# Altium project PCB_Project_CDCEMU2000HW01.PrjPcb
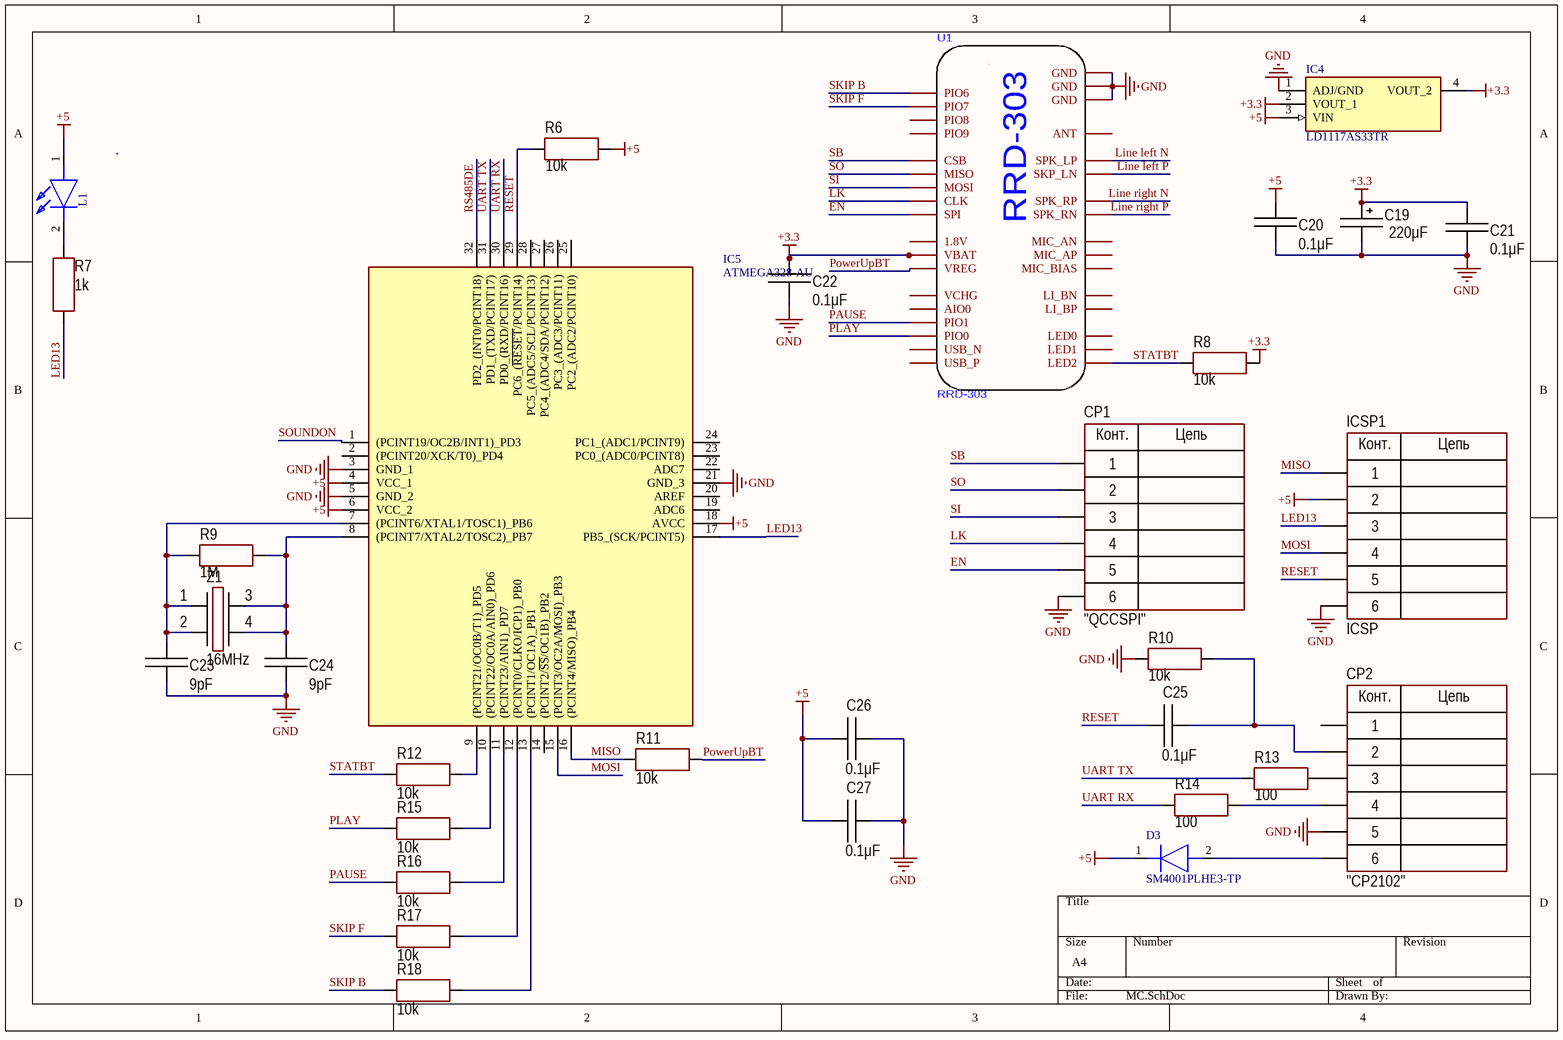
[diagram p0: MC.SchDoc]
3 sheets, 113 parts. Net scope: global (net labels, ports and power ports of the same name join across sheets).
Board file: PCB_CDCEMU2000HW01.PcbDoc
Sheets:
  MC.SchDoc
  Relay and connector.SchDoc
  DIFFAMP.SchDoc

## Sheet MC.SchDoc
size A4; SheetNumber: 1; SheetTotal: 3

### Parts
C19  value 220μF  [CAP: D10C5H20]
C20  value 0.1μF  [CAP: 0805]
C21  value 0.1μF  [CAP: 0805]
C22  value 0.1μF  [CAP: 0805]
C23  value 9pF  [CAP: 0805]
C24  value 9pF  [CAP: 0805]
C25  value 0.1μF  [CAP: 0805]
C26  value 0.1μF  [CAP: 0805]
C27  value 0.1μF  [CAP: 0805]
CP1  CommentText: "QCCSPI"  [CON: PLS-6]
CP2  CommentText: "CP2102"  [CON: PLS-6]
D3  SM4001PLHE3-TP  [SODFL3616X135N]
IC4  LD1117AS33TR  [SOT230P700X190-4N]
IC5  ATMEGA328-AU  [QFP80P900X900X120-32N]
ICSP1  CommentText: ICSP  [CON: PBD-6]
L1  KP2012SGC  [KP2012SGC]  (value not drawn)
R6  value 10k  [RES: 0805]
R7  value 1k  [RES: 0805]
R8  value 10k  [RES: 0805]
R9  value 1M  [RES: 0805]
R10  value 10k  [RES: 0805]
R11  value 10k  [RES: 0805]
R12  value 10k  [RES: 0805]
R13  value 100  [RES: 0805]
R14  value 100  [RES: 0805]
R15  value 10k  [RES: 0805]
R16  value 10k  [RES: 0805]
R17  value 10k  [RES: 0805]
R18  value 10k  [RES: 0805]
U1  RRD-303  [RRD-303]
Z1  Frequency: 16MHz  [OSC: 2520]

### Nets
+3.3: C19.1 C21.1 C22.1 IC4.2(VOUT_1) IC4.4(VOUT_2) R8.2 U1.12(VBAT)
+5: C20.1 C26.2 C27.2 D3.1(K) IC4.3(VIN) IC5.4(VCC_1) IC5.6(VCC_2) IC5.18(AVCC) ICSP1.2 L1.1(A) R6.2
GND: C19.2 C20.2 C21.2 C22.2 C23.2 C24.2 C26.1 C27.1 CP1.6 CP2.5 IC4.1(ADJ/GND) IC5.3(GND_1) IC5.5(GND_2) IC5.21(GND_3) ICSP1.6 R10.1 U1.1(GND) U1.15(GND) U1.27(GND)
EN: CP1.5 U1.10(SPI)
LED13: IC5.17(PB5_(SCK/PCINT5)) ICSP1.3 R7.1
Line left N: U1.16(SPK_LP)
Line left P: U1.17(SKP_LN)
Line right N: U1.18(SPK_RP)
Line right P: U1.19(SPK_RN)
LK: CP1.4 U1.9(CLK)
MISO: IC5.16((PCINT4/MISO)_PB4) ICSP1.1 R11.1
MOSI: IC5.15((PCINT3/OC2A/MOSI)_PB3) ICSP1.4
PAUSE: R16.1 U1.30(PIO1)
PLAY: R15.1 U1.31(PIO0)
PowerUpBT: R11.2 U1.13(VREG)
RESET: C25.2 IC5.29(PC6_(~{RESET}/PCINT14)) ICSP1.5 R6.1
RS485DE: IC5.32(PD2_(INT0/PCINT18))
SB: CP1.1 U1.6(CSB)
SI: CP1.3 U1.8(MOSI)
SKIP B: R18.1 U1.2(PIO6)
SKIP F: R17.1 U1.3(PIO7)
SO: CP1.2 U1.7(MISO)
SOUNDON: IC5.1((PCINT19/OC2B/INT1)_PD3)
STATBT: R8.1 R12.1 U1.34(LED2)
UART RX: IC5.30(PD0_(RXD/PCINT16)) R14.1
UART TX: IC5.31(PD1_(TXD/PCINT17)) R13.1
NetC23_1: C23.1 IC5.7((PCINT6/XTAL1/TOSC1)_PB6) R9.1 Z1.1 Z1.2
NetC24_1: C24.1 IC5.8((PCINT7/XTAL2/TOSC2)_PB7) R9.2 Z1.3 Z1.4
NetC25_1: C25.1 CP2.2 R10.2
NetCP2_3: CP2.3 R13.2
NetCP2_4: CP2.4 R14.2
NetCP2_6: CP2.6 D3.2(A)
NetIC5_9: IC5.9((PCINT21/OC0B/T1)_PD5) R12.2
NetIC5_10: IC5.10((PCINT22/OC0A/AIN0)_PD6) R15.2
NetIC5_11: IC5.11((PCINT23/AIN1)_PD7) R16.2
NetIC5_12: IC5.12((PCINT0/CLKO/ICP1)_PB0) R17.2
NetIC5_13: IC5.13((PCINT1/OC1A)_PB1) R18.2
NetL1_2: L1.2(K) R7.2

Not connected (* = marked no-connect by the designer): CP2 1; IC5 2((PCINT20/XCK/T0)_PD4) 14((PCINT2/~{SS}/OC1B)_PB2) 19(ADC6) 20(AREF) 22(ADC7) 23(PC0_(ADC0/PCINT8)) 24(PC1_(ADC1/PCINT9)) 25(PC2_(ADC2/PCINT10)) 26(PC3_(ADC3/PCINT11)) 27(PC4_(ADC4/SDA/PCINT12)) 28(PC5_(ADC5/SCL/PCINT13)); U1 4(PIO8) 5(PIO9) 11(1.8V) 14(ANT) 20(MIC_AN) 21(MIC_AP) 22(MIC_BIAS) 23(LI_BN) 24(LI_BP) 25(LED0) 26(LED1) 28(VCHG) 29(AIO0) 32(USB_N) 33(USB_P)

### Notes on the sheet
- (in symbol PBD-6) Конт.; Цепь
- (in symbol PLS-6) Конт.; Цепь

### Library data of the parts
C19 = Aluminium: Manufacturer: Wurth; PartNumber: 860080475013; ValueManufacturerPartNumber: Aluminium capacitor, 220μF, 25V, ±20%, 54mOhm, 14x10x5 mm, -55...+105°C; TypeCapacitor: Aluminium capacitor; Tolerance: ±20%; Impedance: 54mOhm; Voltage: 25V; Package: 14x10x5 mm; HelpURL: https://www.digikey.com/product-detail/en/wurth-electronics-inc/860080475013/732-9029-1-ND/5728972; Temperature: -55...+105°C
C20-C27 = Ceramic_0805: Manufacturer: Yageo; PartNumber: CC0805KRX7R7BB104; TypeCapacitor: Ceramic capacitor; Tolerance: ±10%; TypeDielectric: X7R; Package: 0805; HelpURL: https://www.digikey.com/product-detail/en/yageo/CC0805KRX7R7BB104/311-1142-1-ND/303052; ValueManufacturerPartNumber: =TypeCapacitor+', '+Value+', '+TypeDielectric+', '+Tolerance+', '+Voltage+', '+Package+', '+Temperature; Temperature: -55...+125°C
CP1 CP2 = PLS-6: Manufacturer: Connfly; ValueManufacturerPartNumber: Connector, 6pin, 2.54mm, 500VAC, 3A; TypeConnector: Connector; VoltageMax: 500VAC; Pitch: 2.54mm; CurrentMax: 3A; Multichannel: 6pin; HelpURL: https://www.chipdip.ru/product/pls-6; PartNumber: PLS-6
D3 = SM4001PLHE3-TP: Diode; Manufacturer_Name: MCC; Datasheet Link: https://www.mccsemi.com/pdf/Products/SM4001PLHE3-SM4007PLHE3(SOD-123FL).pdf; Height: 1.35mm; Manufacturer_Part_Number: SM4001PLHE3-TP; Mouser Part Number: 833-SM4001PLHE3-TP; Mouser Price/Stock: https://www.mouser.co.uk/ProductDetail/Micro-Commercial-Components-MCC/SM4001PLHE3-TP?qs=QNEnbhJQKvZveZWFAoodWg%3D%3D; Arrow Part Number: SM4001PLHE3-TP; Arrow Price/Stock: https://www.arrow.com/en/products/sm4001plhe3-tp/micro-commercial-components?region=nac
IC4 = LD1117AS33TR: Power Supply; Manufacturer_Name: STMicroelectronics; Datasheet Link: https://4donline.ihs.com/images/VipMasterIC/IC/SGST/SGSTS49356/SGSTS49356-1.pdf?hkey=6D3A4C79FDBF58556ACFDE234799DDF0; Height: 1.9mm; Manufacturer_Part_Number: LD1117AS33TR; Mouser Part Number: 511-LD1117AS33; Mouser Price/Stock: https://www.mouser.co.uk/ProductDetail/STMicroelectronics/LD1117AS33TR?qs=C3bf%2FVrkE5CoDDd7wyn%252BaQ%3D%3D; Arrow Part Number: LD1117AS33TR; Arrow Price/Stock: https://www.arrow.com/en/products/ld1117as33tr/stmicroelectronics?region=europe
IC5 = ATMEGA328-AU: Integrated Circuit; Manufacturer_Name: Microchip; Datasheet Link: https://ww1.microchip.com/downloads/en/DeviceDoc/ATmega48A-PA-88A-PA-168A-PA-328-P-DS-DS40002061B.pdf; Height: 1.2mm; Manufacturer_Part_Number: ATMEGA328-AU; Mouser Part Number: 556-ATMEGA328-AU; Mouser Price/Stock: https://www.mouser.co.uk/ProductDetail/Microchip-Technology/ATMEGA328-AU?qs=lwdSMh1%2FoYJRHuGBjWz9Pg%3D%3D; Arrow Part Number: ATMEGA328-AU; Arrow Price/Stock: https://www.arrow.com/en/products/atmega328-au/microchip-technology?region=europe
ICSP1 = PBD-6: Manufacturer: Connfly; ValueManufacturerPartNumber: Connector, 6pin, 2.54mm, 500VAC, 3A; TypeConnector: Connector; VoltageMax: 500VAC; Pitch: 2.54mm; CurrentMax: 3A; Multichannel: 6pin; HelpURL: https://www.chipdip.ru/product/pbd-6; PartNumber: PBD-6
L1 = KP2012SGC: LED; Manufacturer_Name: Kingbright; Datasheet Link: https://docs.rs-online.com/9e3e/0900766b8032fa8b.pdf; Height: 1.1mm; Manufacturer_Part_Number: KP2012SGC; Mouser Part Number: N/A; Mouser Price/Stock: https://www.mouser.co.uk/ProductDetail/Kingbright/KP2012SGC?qs=5aG0NVq1C4xgkmzx8ebWbQ%3D%3D
R6 R8 R10-R12 R15-R18 = Resistor_0805: Manufacturer: Yageo; PartNumber: RC0805JR-07100RL; ValueManufacturerPartNumber: Resistor film, 10k, ±5%, 0805, 0.125W, -55...+125°C; TypeResistor: Resistor film; Power: 0.125W; Tolerance: ±5%; Package: 0805; HelpURL: https://www.digikey.com/product-detail/en/yageo/RC0805JR-07100RL/311-100ARCT-ND/731185; Temperature: -55...+125°C
R7 = Resistor_0805: Manufacturer: Yageo; PartNumber: RC0805JR-07100RL; ValueManufacturerPartNumber: Resistor film, 1k, ±5%, 0805, 0.125W, -55...+125°C; TypeResistor: Resistor film; Power: 0.125W; Tolerance: ±5%; Package: 0805; HelpURL: https://www.digikey.com/product-detail/en/yageo/RC0805JR-07100RL/311-100ARCT-ND/731185; Temperature: -55...+125°C
R9 = Resistor_0805: Manufacturer: Yageo; PartNumber: RC0805JR-07100RL; ValueManufacturerPartNumber: Resistor film, 1M, ±5%, 0805, 0.125W, -55...+125°C; TypeResistor: Resistor film; Power: 0.125W; Tolerance: ±5%; Package: 0805; HelpURL: https://www.digikey.com/product-detail/en/yageo/RC0805JR-07100RL/311-100ARCT-ND/731185; Temperature: -55...+125°C
R13 R14 = Resistor_0805: Manufacturer: Yageo; PartNumber: RC0805JR-07100RL; ValueManufacturerPartNumber: Resistor film, 100, ±5%, 0805, 0.125W, -55...+125°C; TypeResistor: Resistor film; Power: 0.125W; Tolerance: ±5%; Package: 0805; HelpURL: https://www.digikey.com/product-detail/en/yageo/RC0805JR-07100RL/311-100ARCT-ND/731185; Temperature: -55...+125°C
Z1 = Crystal_2520: Manufacturer: Epson; PartNumber: FA-20H 16.0000MF20X-B; ValueManufacturerPartNumber: Crystal, 16MHz, 16pF, ±20ppm, case 2520, -40...+85°C; LoadCapacitance: 16pF; Tolerance: ±20ppm; Package: case 2520; HelpURL: https://www.digikey.com/product-detail/en/epson/FA-20H-16.0000MF20X-B/SER4202-ND/7430937; Temperature: -40...+85°C; TypeOscilator: Crystal

## Sheet Relay and connector.SchDoc
size A4; SheetNumber: 2; SheetTotal: 3
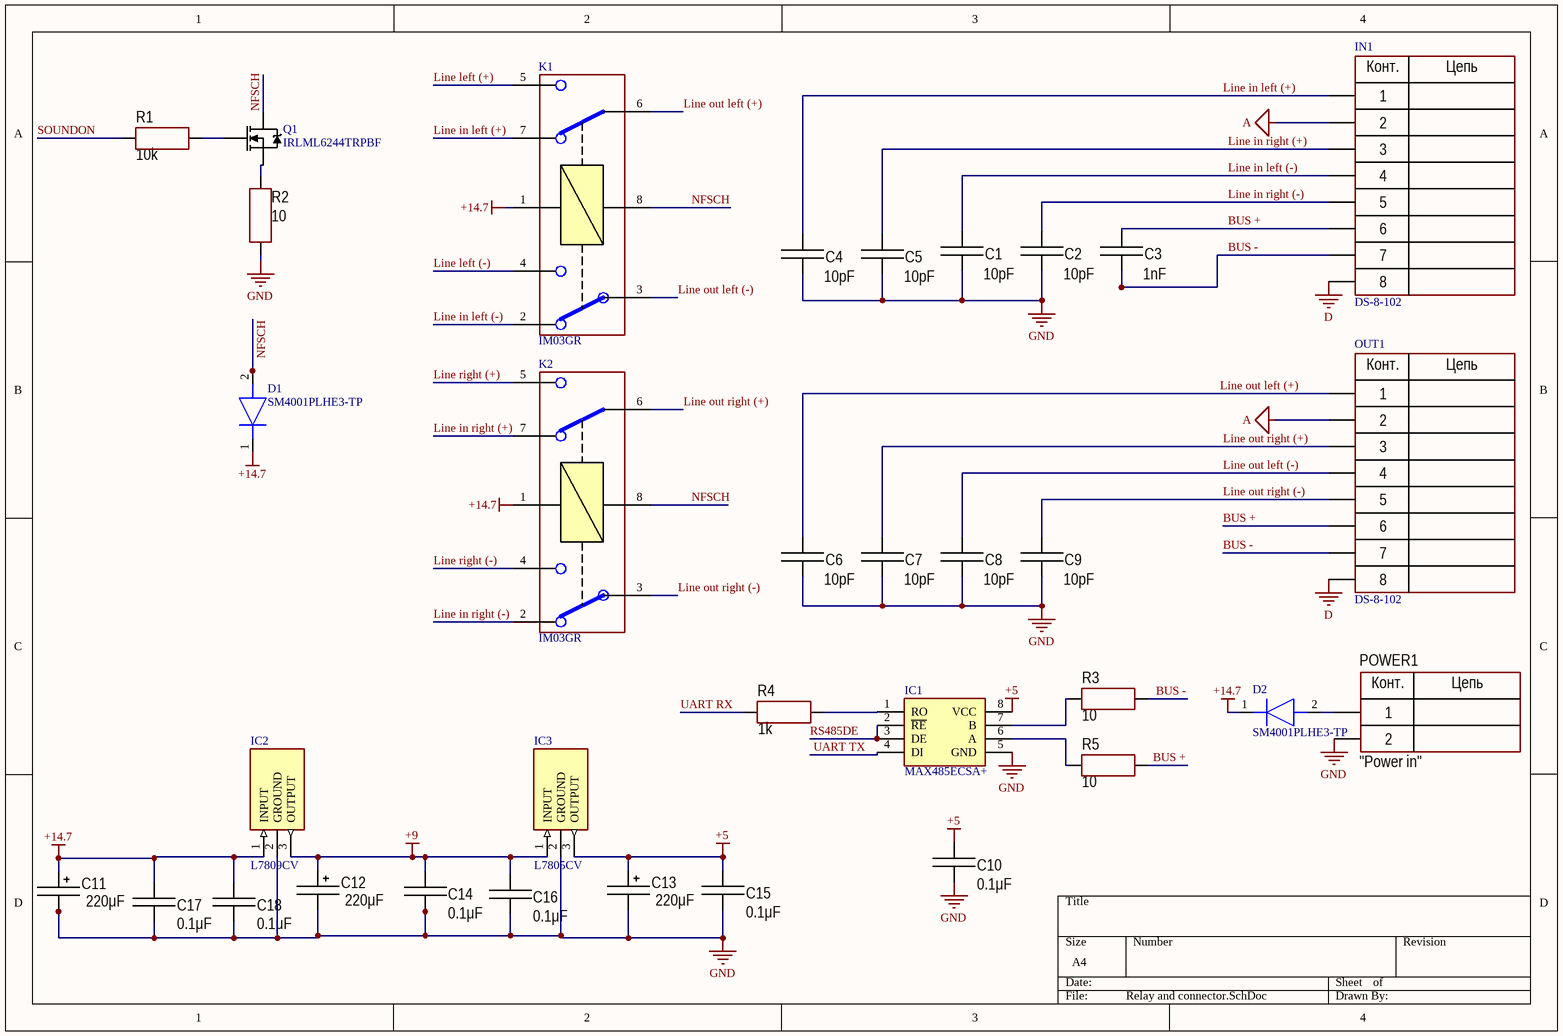
[diagram p1: Relay and connector.SchDoc]

### Parts
C1  value 10pF  [CAP: 0805]
C2  value 10pF  [CAP: 0805]
C3  value 1nF  [CAP: 0805]
C4  value 10pF  [CAP: 0805]
C5  value 10pF  [CAP: 0805]
C6  value 10pF  [CAP: 0805]
C7  value 10pF  [CAP: 0805]
C8  value 10pF  [CAP: 0805]
C9  value 10pF  [CAP: 0805]
C10  value 0.1μF  [CAP: 0805]
C11  value 220μF  [CAP: D10C5H20]
C12  value 220μF  [CAP: D10C5H20]
C13  value 220μF  [CAP: D10C5H20]
C14  value 0.1μF  [CAP: 0805]
C15  value 0.1μF  [CAP: 0805]
C16  value 0.1μF  [CAP: 0805]
C17  value 0.1μF  [CAP: 0805]
C18  value 0.1μF  [CAP: 0805]
D1  SM4001PLHE3-TP  [SODFL3616X135N]
D2  SM4001PLHE3-TP  [SODFL3616X135N]
IC1  MAX485ECSA+  [SOIC127P600X175-8N]
IC2  L7809CV  [TO255P460X1020X2008-3P]
IC3  L7805CV  [TO255P460X1020X2008-3P]
IN1  DS-8-102  [DS-8-102]
K1  IM03GR  [IM06GR]
K2  IM03GR  [IM06GR]
OUT1  DS-8-102  [DS-8-102]
POWER1  CommentText: "Power in"  [CON: CWF-2]
Q1  IRLML6244TRPBF  [SOT95P237X112-3N]
R1  value 10k  [RES: 0805]
R2  value 10  [RES: 0805]
R3  value 10  [RES: 0805]
R4  value 1k  [RES: 0805]
R5  value 10  [RES: 0805]

### Nets
+5: C10.1 C13.1 C15.1 IC1.8(VCC) IC3.3(OUTPUT)
+9: C12.1 C14.1 C16.1 IC2.3(OUTPUT) IC3.1(INPUT)
+14.7: C11.1 C17.1 C18.1 D1.1(K) D2.1(K) IC2.1(INPUT) K1.1 K2.1
A: IN1.2 OUT1.2
D: IN1.8 OUT1.8
GND: C1.1 C2.1 C4.1 C5.1 C6.1 C7.1 C8.1 C9.1 C10.2 C11.2 C12.2 C13.2 C14.2 C15.2 C16.2 C17.2 C18.2 IC1.5(GND) IC2.2(GROUND) IC3.2(GROUND) POWER1.2 R2.1
BUS +: C3.2 IN1.6 OUT1.6 R5.2
BUS -: C3.1 IN1.7 OUT1.7 R3.2
Line in left (+): C4.2 IN1.1 K1.7
Line in left (-): C1.2 IN1.4 K1.2
Line in right (+): C5.2 IN1.3 K2.7
Line in right (-): C2.2 IN1.5 K2.2
Line left (+): K1.5
Line left (-): K1.4
Line out left (+): C6.2 K1.6 OUT1.1
Line out left (-): C8.2 K1.3 OUT1.4
Line out right (+): C7.2 K2.6 OUT1.3
Line out right (-): C9.2 K2.3 OUT1.5
Line right (+): K2.5
Line right (-): K2.4
NFSCH: D1.2(A) K1.8 K2.8 Q1.3(D)
RS485DE: IC1.2(~{RE}) IC1.3(DE)
SOUNDON: R1.1
UART RX: R4.1
UART TX: IC1.4(DI)
NetD2_2: D2.2(A) POWER1.1
NetIC1_1: IC1.1(RO) R4.2
NetIC1_6: IC1.6(A) R5.1
NetIC1_7: IC1.7(B) R3.1
NetQ1_1: Q1.1(G) R1.2
NetQ1_2: Q1.2(S) R2.2

### Notes on the sheet
- (in symbol CWF-2) Конт.; Цепь
- (in symbol DS-8-102) Конт.; Цепь

### Library data of the parts
C1 C2 C4-C9 = Ceramic_0805: Manufacturer: Yageo; PartNumber: CC0805KRX7R7BB104; ValueManufacturerPartNumber: Ceramic capacitor, 10pF, X7R, ±10%, 16V, 0805, -55...+125°C; TypeCapacitor: Ceramic capacitor; Tolerance: ±10%; TypeDielectric: X7R; Voltage: 16V; Package: 0805; HelpURL: https://www.digikey.com/product-detail/en/yageo/CC0805KRX7R7BB104/311-1142-1-ND/303052; Temperature: -55...+125°C
C3 = Ceramic_0805: Manufacturer: Yageo; PartNumber: CC0805KRX7R7BB104; ValueManufacturerPartNumber: Ceramic capacitor, 1nF, X7R, ±10%, 16V, 0805, -55...+125°C; TypeCapacitor: Ceramic capacitor; Tolerance: ±10%; TypeDielectric: X7R; Voltage: 16V; Package: 0805; HelpURL: https://www.digikey.com/product-detail/en/yageo/CC0805KRX7R7BB104/311-1142-1-ND/303052; Temperature: -55...+125°C
C10 C14-C18 = Ceramic_0805: as C20 on sheet MC; Package: 0805; HelpURL: https://www.digikey.com/product-detail/en/yageo/CC0805KRX7R7BB104/311-1142-1-ND/303052; ValueManufacturerPartNumber: =TypeCapacitor+', '+Value+', '+TypeDielectric+', '+Tolerance+', '+Voltage+', '+Package+', '+Temperature; Temperature: -55...+125°C
C11-C13 = Aluminium: as C19 on sheet MC; Package: 14x10x5 mm; HelpURL: https://www.digikey.com/product-detail/en/wurth-electronics-inc/860080475013/732-9029-1-ND/5728972; Temperature: -55...+105°C
D1 D2 = SM4001PLHE3-TP: Diode; Manufacturer_Name: MCC; Datasheet Link: https://www.mccsemi.com/pdf/Products/SM4001PLHE3-SM4007PLHE3(SOD-123FL).pdf; Height: 1.35mm; Manufacturer_Part_Number: SM4001PLHE3-TP; Mouser Part Number: 833-SM4001PLHE3-TP; Mouser Price/Stock: https://www.mouser.co.uk/ProductDetail/Micro-Commercial-Components-MCC/SM4001PLHE3-TP?qs=QNEnbhJQKvZveZWFAoodWg%3D%3D; Arrow Part Number: SM4001PLHE3-TP; Arrow Price/Stock: https://www.arrow.com/en/products/sm4001plhe3-tp/micro-commercial-components?region=nac
IC1 = MAX485ECSA+: Integrated Circuit; Manufacturer_Name: Analog Devices; Datasheet Link: http://datasheets.maximintegrated.com/en/ds/MAX1487E-MAX491E.pdf; Height: 1.75mm; Manufacturer_Part_Number: MAX485ECSA+; Mouser Part Number: 700-MAX485ECSA; Mouser Price/Stock: https://www.mouser.co.uk/ProductDetail/Analog-Devices-Maxim-Integrated/MAX485ECSA%2b?qs=1THa7WoU59Gy3FCdT5o1Tg%3D%3D; Arrow Part Number: MAX485ECSA+; Arrow Price/Stock: https://www.arrow.com/en/products/max485ecsa/maxim-integrated?region=nac
IC2 = L7809CV: Integrated Circuit; Manufacturer_Name: STMicroelectronics; Datasheet Link: http://www.st.com/web/en/resource/technical/document/datasheet/CD00000444.pdf; Height: 4.6mm; Manufacturer_Part_Number: L7809CV; Mouser Part Number: 511-L7809CV; Mouser Price/Stock: https://www.mouser.co.uk/ProductDetail/STMicroelectronics/L7809CV?qs=sps7W%2FwBcGH358Eg%2FiFhSA%3D%3D; Arrow Part Number: L7809CV; Arrow Price/Stock: https://www.arrow.com/en/products/l7809cv/stmicroelectronics?region=europe
IC3 = L7805CV: Integrated Circuit; Manufacturer_Name: STMicroelectronics; Datasheet Link: http://www.st.com/web/en/resource/technical/document/datasheet/CD00000444.pdf; Height: 4.6mm; Manufacturer_Part_Number: L7805CV; Mouser Part Number: 511-L7805CV; Mouser Price/Stock: https://www.mouser.co.uk/ProductDetail/STMicroelectronics/L7805CV?qs=9NrABl3fj%2FqplZAHiYUxWg%3D%3D; Arrow Part Number: L7805CV; Arrow Price/Stock: https://www.arrow.com/en/products/l7805cv/stmicroelectronics?region=europe
K1 K2 = IM03GR: Relay or Contactor; Manufacturer_Name: TE Connectivity; Datasheet Link: https://datasheet.datasheetarchive.com/originals/distributors/Datasheets_SAMA/af0478e68580ade93768a4593bd7be66.pdf; Manufacturer_Part_Number: IM03GR; Mouser Part Number: 655-IM03GR; Mouser Price/Stock: https://www.mouser.co.uk/ProductDetail/TE-Connectivity/IM03GR?qs=h8jywBNgiq20bLq7q22y%252Bg%3D%3D; Arrow Part Number: IM03GR; Arrow Price/Stock: https://www.arrow.com/en/products/im03gr/te-connectivity?region=nac
POWER1 = CWF-2: Manufacturer: Connfly; ValueManufacturerPartNumber: Connector, 2pin, 2.54mm, 250VAC, 3A; PartNumber: CWF-2R; TypeConnector: Connector; VoltageMax: 250VAC; Pitch: 2.54mm; CurrentMax: 3A; Multichannel: 2pin; HelpURL: https://www.chipdip.ru/product/cwf-2r-ds1069-2-mr
Q1 = IRLML6244TRPBF: Transistor; Manufacturer_Name: Infineon; Datasheet Link: http://www.infineon.com/dgdl/irlml6244pbf.pdf?fileId=5546d462533600a4015356686fed261f; Height: 1.12mm; Manufacturer_Part_Number: IRLML6244TRPBF; Mouser Part Number: 942-IRLML6244TRPBF; Mouser Price/Stock: https://www.mouser.co.uk/ProductDetail/Infineon-Technologies/IRLML6244TRPBF?qs=9%252BKlkBgLFf1HkY%2F2U%252BIhLQ%3D%3D; Arrow Part Number: IRLML6244TRPBF; Arrow Price/Stock: https://www.arrow.com/en/products/irlml6244trpbf/infineon-technologies-ag?region=europe
R1 = Resistor_0805: as R6 on sheet MC; Package: 0805; HelpURL: https://www.digikey.com/product-detail/en/yageo/RC0805JR-07100RL/311-100ARCT-ND/731185; Temperature: -55...+125°C
R2 R3 R5 = Resistor_0805: Manufacturer: Yageo; PartNumber: RC0805JR-07100RL; ValueManufacturerPartNumber: Resistor film, 10, ±5%, 0805, 0.125W, -55...+125°C; TypeResistor: Resistor film; Power: 0.125W; Tolerance: ±5%; Package: 0805; HelpURL: https://www.digikey.com/product-detail/en/yageo/RC0805JR-07100RL/311-100ARCT-ND/731185; Temperature: -55...+125°C
R4 = Resistor_0805: as R7 on sheet MC; Package: 0805; HelpURL: https://www.digikey.com/product-detail/en/yageo/RC0805JR-07100RL/311-100ARCT-ND/731185; Temperature: -55...+125°C

## Sheet DIFFAMP.SchDoc
size A4; SheetNumber: 3; SheetTotal: 3
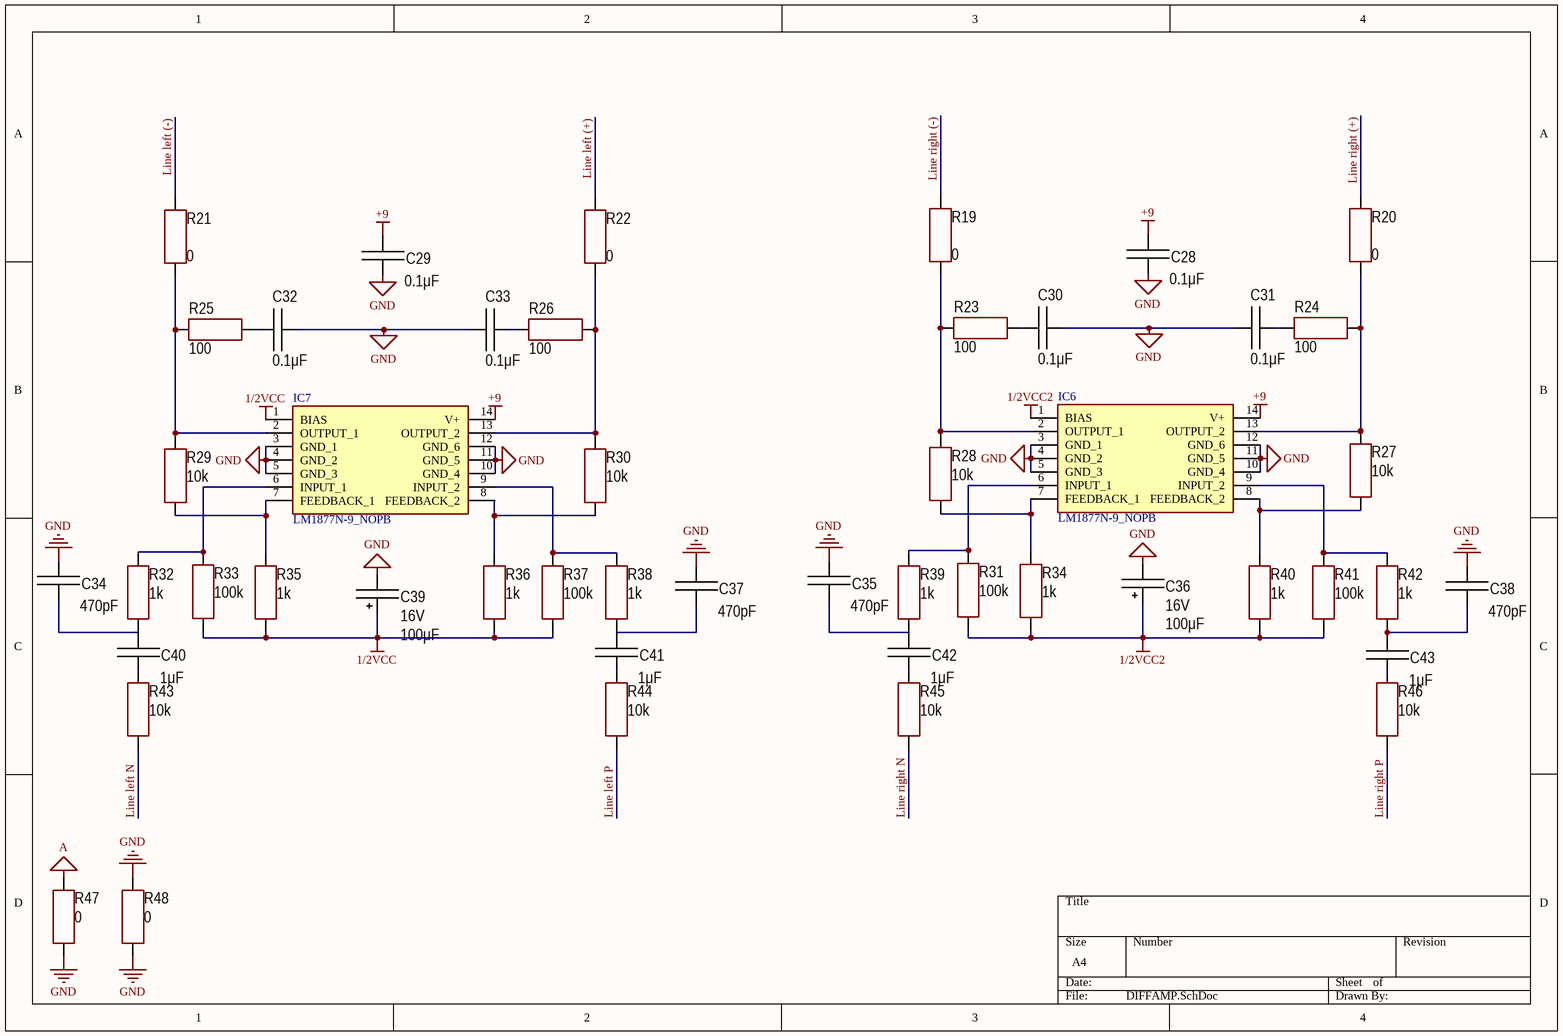
[diagram p2: DIFFAMP.SchDoc]

### Parts
C28  value 0.1μF  [CAP: 0805]
C29  value 0.1μF  [CAP: 0805]
C30  value 0.1μF  [CAP: 0805]
C31  value 0.1μF  [CAP: 0805]
C32  value 0.1μF  [CAP: 0805]
C33  value 0.1μF  [CAP: 0805]
C34  value 470pF  [CAP: 0805]
C35  value 470pF  [CAP: 0805]
C36  value 100μF  Voltage: 16V  [CAP: TANTAL-D]
C37  value 470pF  [CAP: 0805]
C38  value 470pF  [CAP: 0805]
C39  value 100μF  Voltage: 16V  [CAP: TANTAL-D]
C40  value 1μF  [CAP: 0805]
C41  value 1μF  [CAP: 0805]
C42  value 1μF  [CAP: 0805]
C43  value 1μF  [CAP: 0805]
IC6  LM1877N-9_NOPB  [DIP787W58P254L1918H508Q14N]
IC7  LM1877N-9_NOPB  [DIP787W58P254L1918H508Q14N]
R19  value 0  [RES: 0805]
R20  value 0  [RES: 0805]
R21  value 0  [RES: 0805]
R22  value 0  [RES: 0805]
R23  value 100  [RES: 0805]
R24  value 100  [RES: 0805]
R25  value 100  [RES: 0805]
R26  value 100  [RES: 0805]
R27  value 10k  [RES: 0805]
R28  value 10k  [RES: 0805]
R29  value 10k  [RES: 0805]
R30  value 10k  [RES: 0805]
R31  value 100k  [RES: 0805]
R32  value 1k  [RES: 0805]
R33  value 100k  [RES: 0805]
R34  value 1k  [RES: 0805]
R35  value 1k  [RES: 0805]
R36  value 1k  [RES: 0805]
R37  value 100k  [RES: 0805]
R38  value 1k  [RES: 0805]
R39  value 1k  [RES: 0805]
R40  value 1k  [RES: 0805]
R41  value 100k  [RES: 0805]
R42  value 1k  [RES: 0805]
R43  value 10k  [RES: 0805]
R44  value 10k  [RES: 0805]
R45  value 10k  [RES: 0805]
R46  value 10k  [RES: 0805]
R47  value 0  [RES: 0805]
R48  value 0  [RES: 0805]

### Nets
1/2VCC: C39.1 IC7.1(BIAS) R33.2 R35.2 R36.1 R37.2
1/2VCC2: C36.1 IC6.1(BIAS) R31.2 R34.2 R40.1 R41.2
+9: C28.2 C29.2 IC6.14(V+) IC7.14(V+)
A: R47.1
GND: C28.1 C29.1 C30.1 C31.1 C32.1 C33.1 C34.2 C35.2 C36.2 C37.2 C38.2 C39.2 IC6.3(GND_1) IC6.4(GND_2) IC6.5(GND_3) IC6.10(GND_4) IC6.11(GND_5) IC6.12(GND_6) IC7.3(GND_1) IC7.4(GND_2) IC7.5(GND_3) IC7.10(GND_4) IC7.11(GND_5) IC7.12(GND_6) R47.2 R48.1 R48.2
Line left (+): R22.2
Line left (-): R21.2
Line left N: R43.2
Line left P: R44.2
Line right (+): R20.2
Line right (-): R19.2
Line right N: R45.2
Line right P: R46.2
NetC30_2: C30.2 R23.1
NetC31_2: C31.2 R24.2
NetC32_2: C32.2 R25.1
NetC33_2: C33.2 R26.2
NetC34_1: C34.1 C40.2 R32.2
NetC35_1: C35.1 C42.2 R39.2
NetC37_1: C37.1 C41.2 R38.2
NetC38_1: C38.1 C43.2 R42.2
NetC40_1: C40.1 R43.1
NetC41_1: C41.1 R44.1
NetC42_1: C42.1 R45.1
NetC43_1: C43.1 R46.1
NetIC6_2: IC6.2(OUTPUT_1) R19.1 R23.2 R28.1
NetIC6_6: IC6.6(INPUT_1) R31.1 R39.1
NetIC6_7: IC6.7(FEEDBACK_1) R28.2 R34.1
NetIC6_8: IC6.8(FEEDBACK_2) R27.2 R40.2
NetIC6_9: IC6.9(INPUT_2) R41.1 R42.1
NetIC6_13: IC6.13(OUTPUT_2) R20.1 R24.1 R27.1
NetIC7_2: IC7.2(OUTPUT_1) R21.1 R25.2 R29.1
NetIC7_6: IC7.6(INPUT_1) R32.1 R33.1
NetIC7_7: IC7.7(FEEDBACK_1) R29.2 R35.1
NetIC7_8: IC7.8(FEEDBACK_2) R30.2 R36.2
NetIC7_9: IC7.9(INPUT_2) R37.1 R38.1
NetIC7_13: IC7.13(OUTPUT_2) R22.1 R26.1 R30.1

### Library data of the parts
C28-C33 = Ceramic_0805: Manufacturer: Yageo; PartNumber: CC0805KRX7R7BB104; ValueManufacturerPartNumber: Ceramic capacitor, 0.1μF, X7R, ±10%, 16V, 0805, -55...+125°C; TypeCapacitor: Ceramic capacitor; Tolerance: ±10%; TypeDielectric: X7R; Voltage: 16V; Package: 0805; HelpURL: https://www.digikey.com/product-detail/en/yageo/CC0805KRX7R7BB104/311-1142-1-ND/303052; Temperature: -55...+125°C
C34 C35 C37 C38 = Ceramic_0805: Manufacturer: Yageo; PartNumber: CC0805KRX7R7BB104; ValueManufacturerPartNumber: Ceramic capacitor, 470pF, X7R, ±10%, 16V, 0805, -55...+125°C; TypeCapacitor: Ceramic capacitor; Tolerance: ±10%; TypeDielectric: X7R; Voltage: 16V; Package: 0805; HelpURL: https://www.digikey.com/product-detail/en/yageo/CC0805KRX7R7BB104/311-1142-1-ND/303052; Temperature: -55...+125°C
C36 C39 = Tantal_D: Manufacturer: AVX; PartNumber: TAJD476M035RNJV; ValueManufacturerPartNumber: Tantalum capacitor, 100μF, 16V, ±20%, 900mOhm, case D (7343), -55...+125°C; Impedance: 900mOhm; Tolerance: ±20%; TypeDielectric: X7R; TypeCapacitor: Tantalum capacitor; Package: case D (7343); HelpURL: https://www.digikey.com/product-detail/en/avx-corporation/TAJD476M035RNJV/478-12122-1-ND/8605695; Temperature: -55...+125°C
C40-C43 = Ceramic_0805: Manufacturer: Yageo; PartNumber: CC0805KRX7R7BB104; ValueManufacturerPartNumber: Ceramic capacitor, 1μF, X7R, ±10%, 16V, 0805, -55...+125°C; TypeCapacitor: Ceramic capacitor; Tolerance: ±10%; TypeDielectric: X7R; Voltage: 16V; Package: 0805; HelpURL: https://www.digikey.com/product-detail/en/yageo/CC0805KRX7R7BB104/311-1142-1-ND/303052; Temperature: -55...+125°C
IC6 IC7 = LM1877N-9_NOPB: Integrated Circuit; Manufacturer_Name: Texas Instruments; Manufacturer_Part_Number: LM1877N-9/NOPB; Datasheet Link: http://www.datasheetlib.com/datasheet/52991/lm1877n-9-nopb_national-semiconductor/download.html; Height: 5.08mm; Mouser Part Number: N/A; Mouser Price/Stock: https://www.mouser.com/Search/Refine.aspx?Keyword=N%2FA
R19-R22 R47 R48 = Resistor_0805: Manufacturer: Yageo; PartNumber: RC0805JR-07100RL; ValueManufacturerPartNumber: Resistor film, 0, ±5%, 0805, 0.125W, -55...+125°C; TypeResistor: Resistor film; Power: 0.125W; Tolerance: ±5%; Package: 0805; HelpURL: https://www.digikey.com/product-detail/en/yageo/RC0805JR-07100RL/311-100ARCT-ND/731185; Temperature: -55...+125°C
R23-R26 = Resistor_0805: as R13 on sheet MC; Package: 0805; HelpURL: https://www.digikey.com/product-detail/en/yageo/RC0805JR-07100RL/311-100ARCT-ND/731185; Temperature: -55...+125°C
R27-R30 R43-R46 = Resistor_0805: as R6 on sheet MC; Package: 0805; HelpURL: https://www.digikey.com/product-detail/en/yageo/RC0805JR-07100RL/311-100ARCT-ND/731185; Temperature: -55...+125°C
R31 R33 R37 R41 = Resistor_0805: Manufacturer: Yageo; PartNumber: RC0805JR-07100RL; ValueManufacturerPartNumber: Resistor film, 100k, ±5%, 0805, 0.125W, -55...+125°C; TypeResistor: Resistor film; Power: 0.125W; Tolerance: ±5%; Package: 0805; HelpURL: https://www.digikey.com/product-detail/en/yageo/RC0805JR-07100RL/311-100ARCT-ND/731185; Temperature: -55...+125°C
R32 R34-R36 R38-R40 R42 = Resistor_0805: as R7 on sheet MC; Package: 0805; HelpURL: https://www.digikey.com/product-detail/en/yageo/RC0805JR-07100RL/311-100ARCT-ND/731185; Temperature: -55...+125°C

## Nets that join several sheets
+5: MC (11 pins), Relay and connector (5 pins)
+9: Relay and connector (5 pins), DIFFAMP (C28.2 C29.2 IC6.14 IC7.14)
A: Relay and connector (IN1.2 OUT1.2), DIFFAMP (R47.1)
GND: MC (19 pins), Relay and connector (22 pins), DIFFAMP (27 pins)
Line left (+): Relay and connector (K1.5), DIFFAMP (R22.2)
Line left (-): Relay and connector (K1.4), DIFFAMP (R21.2)
Line left N: MC (U1.16), DIFFAMP (R43.2)
Line left P: MC (U1.17), DIFFAMP (R44.2)
Line right (+): Relay and connector (K2.5), DIFFAMP (R20.2)
Line right (-): Relay and connector (K2.4), DIFFAMP (R19.2)
Line right N: MC (U1.18), DIFFAMP (R45.2)
Line right P: MC (U1.19), DIFFAMP (R46.2)
RS485DE: MC (IC5.32), Relay and connector (IC1.2 IC1.3)
SOUNDON: MC (IC5.1), Relay and connector (R1.1)
UART RX: MC (IC5.30 R14.1), Relay and connector (R4.1)
UART TX: MC (IC5.31 R13.1), Relay and connector (IC1.4)